# Altium schematic sheet LCD.SchDoc
size A3; SheetNumber: 4; SheetTotal: 7
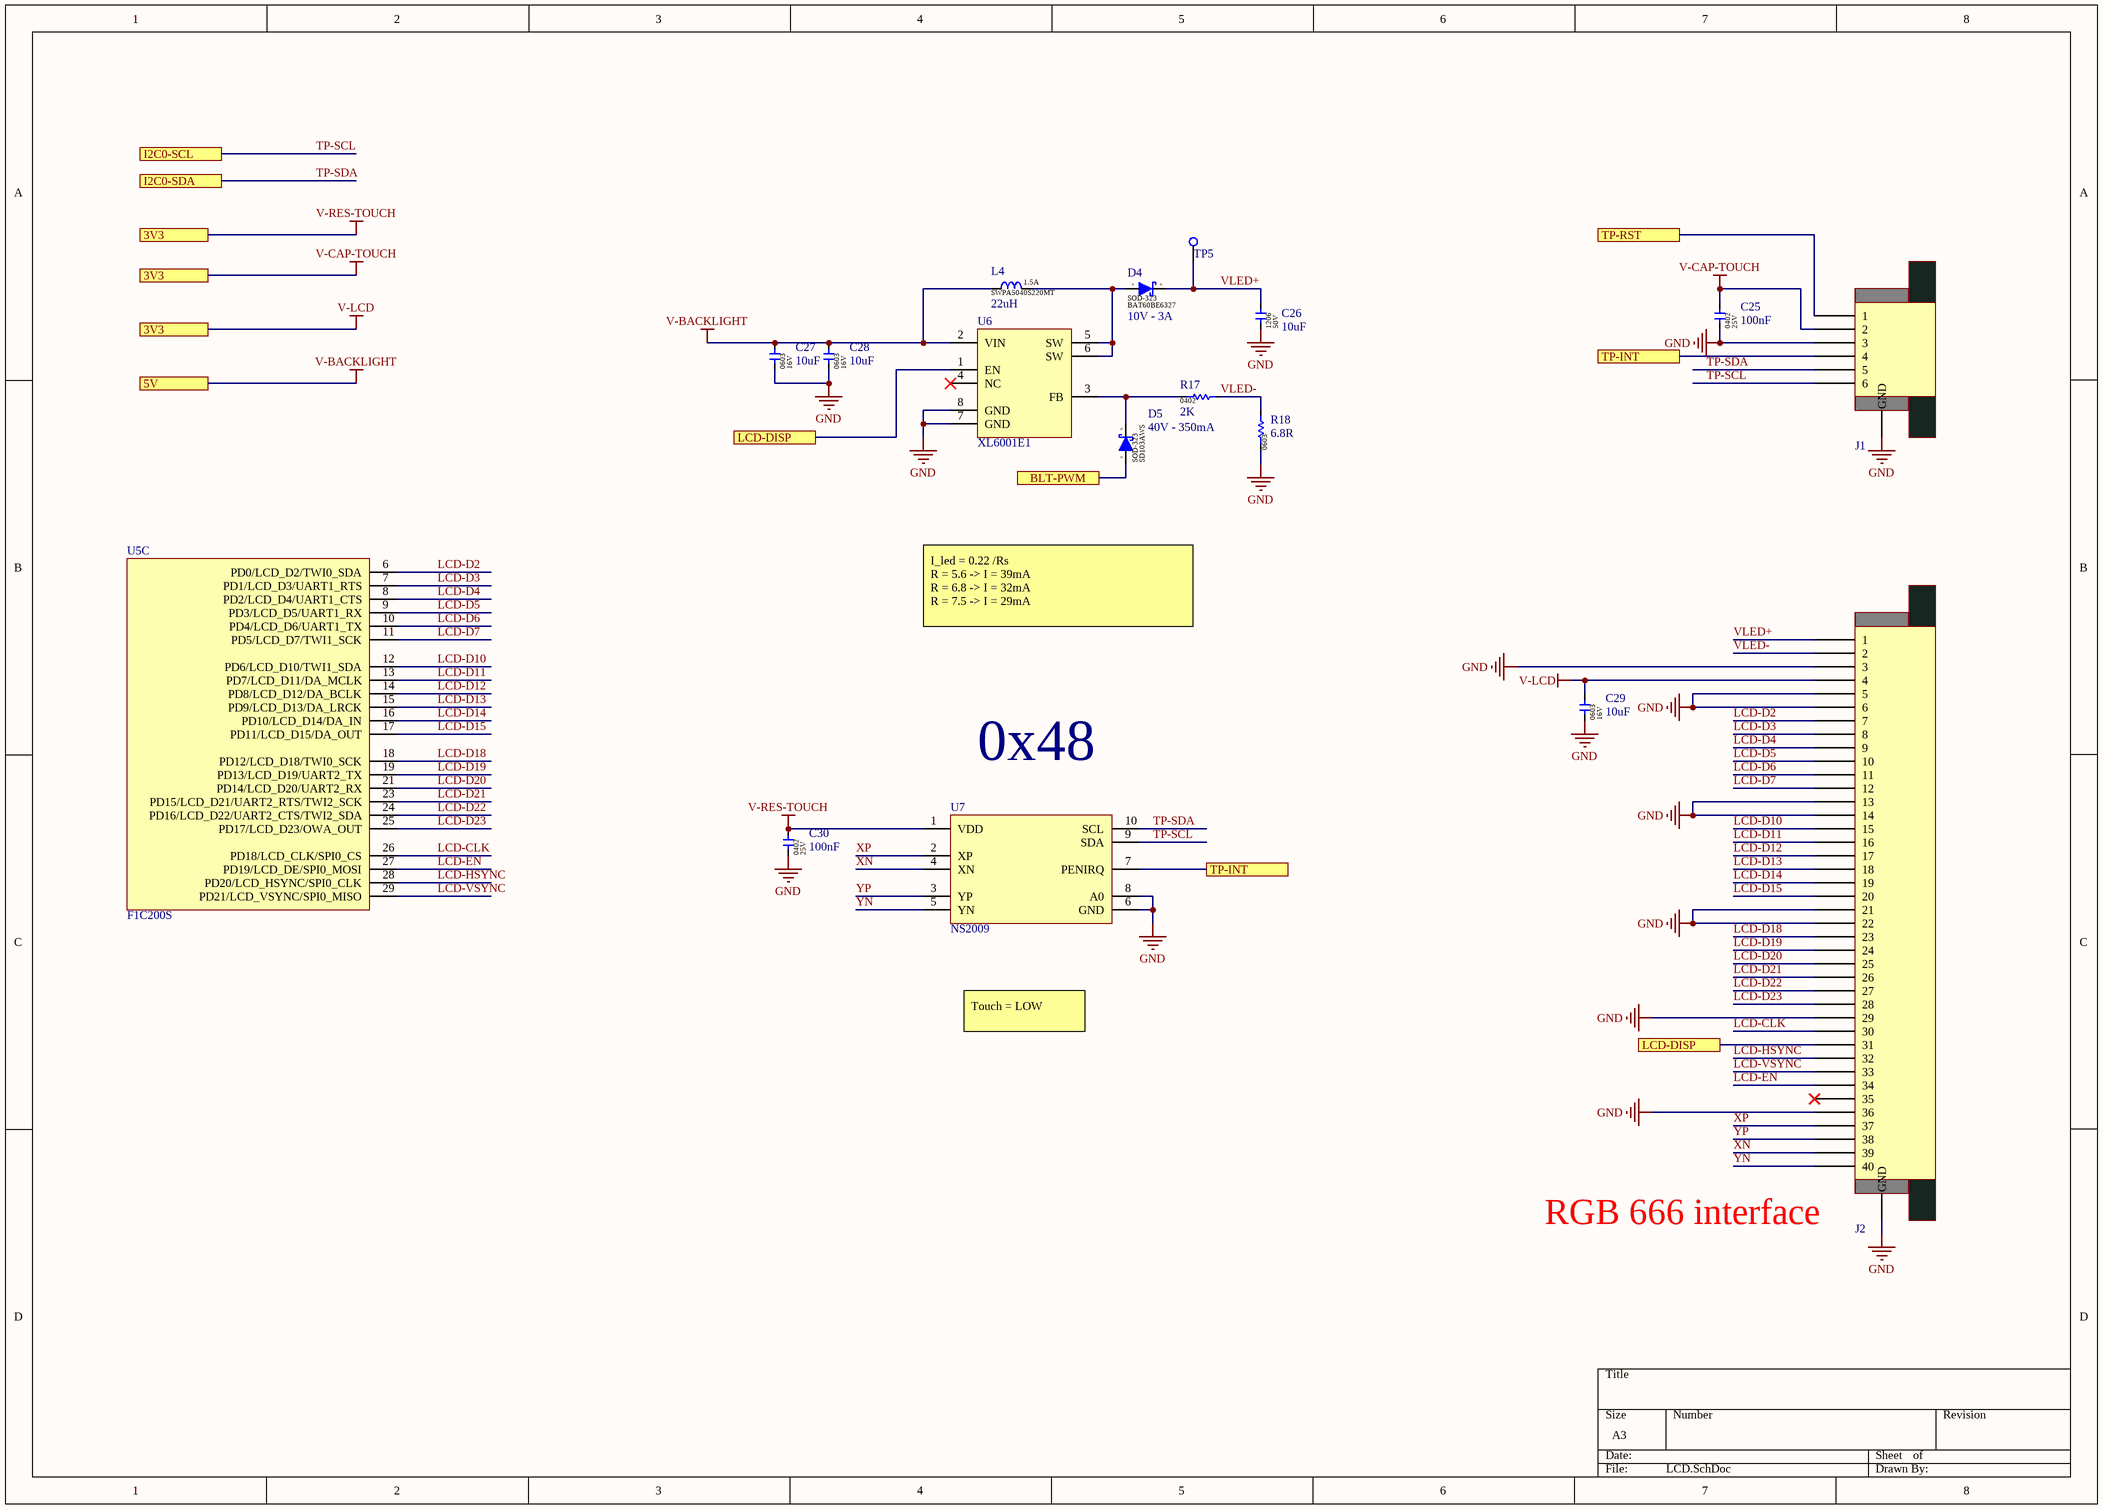
[diagram p0: LCD.SchDoc]

## Parts
C25  100nF  [CAP-0402]
C26  10uF  [CAP-1206]
C27  10uF  [CAP-0603]
C28  10uF  [CAP-0603]
C29  10uF  [CAP-0603]
C30  100nF  [CAP-0402]
D4  10V - 3A  [SOD323 (UNI)]
D5  40V - 350mA  [SOD323 (UNI)]
J1  AFC07-S06ECC-00  [FPC - 6P, 0.5mm, top]  (value not drawn)
J2  AFC07-S40ECC-00  [FPC - 40P, 0.5mm, top]  (value not drawn)
L4  22uH  [IND-5040]
R17  2K  [RES-0402]
R18  6.8R  [RES-0603]
TP5  N/A  [Test point]  (value not drawn)  (no BOM)
U5  F1C200S  [F1Cx00s]  (part C of 6)
U6  XL6001E1  [SOP-8]
U7  NS2009  [MSOP-10]

## Ports
3V3, 5V, BLT-PWM, I2C0-SCL, I2C0-SDA, LCD-DISP, TP-INT, TP-RST

## Nets
GND: C25.1 C26.1 C27.1 C28.1 C29.1 C30.1 J1.0(GND) J1.3 J2.0(GND) J2.3 J2.5 J2.6 J2.13 J2.14 J2.21 J2.22 J2.29 J2.36 R18.1 U6.7(GND) U6.8(GND) U7.6(GND) U7.8(A0)
V-BACKLIGHT: C27.2 C28.2 L4.1 U6.2(VIN) ; port 5V
V-CAP-TOUCH: C25.2 C29.2 C30.2 J1.2 J2.4 U7.1(VDD) ; port 3V3  [also labelled V-LCD, V-RES-TOUCH]
BLT-PWM: D5.2(Anode) ; port BLT-PWM
LCD-CLK: J2.30 U5.26(PD18/LCD_CLK/SPI0_CS)
LCD-D2: J2.7 U5.6(PD0/LCD_D2/TWI0_SDA)
LCD-D3: J2.8 U5.7(PD1/LCD_D3/UART1_RTS)
LCD-D4: J2.9 U5.8(PD2/LCD_D4/UART1_CTS)
LCD-D5: J2.10 U5.9(PD3/LCD_D5/UART1_RX)
LCD-D6: J2.11 U5.10(PD4/LCD_D6/UART1_TX)
LCD-D7: J2.12 U5.11(PD5/LCD_D7/TWI1_SCK)
LCD-D10: J2.15 U5.12(PD6/LCD_D10/TWI1_SDA)
LCD-D11: J2.16 U5.13(PD7/LCD_D11/DA_MCLK)
LCD-D12: J2.17 U5.14(PD8/LCD_D12/DA_BCLK)
LCD-D13: J2.18 U5.15(PD9/LCD_D13/DA_LRCK)
LCD-D14: J2.19 U5.16(PD10/LCD_D14/DA_IN)
LCD-D15: J2.20 U5.17(PD11/LCD_D15/DA_OUT)
LCD-D18: J2.23 U5.18(PD12/LCD_D18/TWI0_SCK)
LCD-D19: J2.24 U5.19(PD13/LCD_D19/UART2_TX)
LCD-D20: J2.25 U5.21(PD14/LCD_D20/UART2_RX)
LCD-D21: J2.26 U5.23(PD15/LCD_D21/UART2_RTS/TWI2_SCK)
LCD-D22: J2.27 U5.24(PD16/LCD_D22/UART2_CTS/TWI2_SDA)
LCD-D23: J2.28 U5.25(PD17/LCD_D23/OWA_OUT)
LCD-DISP: J2.31 U6.1(EN) ; port LCD-DISP
LCD-EN: J2.34 U5.27(PD19/LCD_DE/SPI0_MOSI)
LCD-HSYNC: J2.32 U5.28(PD20/LCD_HSYNC/SPI0_CLK)
LCD-VSYNC: J2.33 U5.29(PD21/LCD_VSYNC/SPI0_MISO)
TP-INT: J1.4 U7.7(PENIRQ) ; port TP-INT
TP-RST: J1.1 ; port TP-RST
TP-SCL: J1.6 U7.9(SDA) ; port I2C0-SCL
TP-SDA: J1.5 U7.10(SCL) ; port I2C0-SDA
VLED+: C26.2 D4.1(Cathode) J2.1 TP5.1
VLED-: J2.2 R17.2 R18.2
XN: J2.39 U7.4(XN)
XP: J2.37 U7.2(XP)
YN: J2.40 U7.5(YN)
YP: J2.38 U7.3(YP)
NetD4_2: D4.2(Anode) L4.2 U6.5(SW) U6.6(SW)
NetD5_1: D5.1(Cathode) R17.1 U6.3(FB)

Not connected (* = marked no-connect by the designer): J2 35*; U6 4(NC)*

## Notes on the sheet
- I_led = 0.22 /Rs
  R = 5.6 -> I = 39mA
  R = 6.8 -> I = 32mA
  R = 7.5 -> I = 29mA
- 0x48
- Touch = LOW
- (near J2) RGB 666 interface
- (in symbol BAT60BE6327) A; K
- (in symbol SD103AWS) K; A

## Library data of the parts
C25 C30 = 0402X104K250CT: 100nF ±10% 25V X5R 0402 Multilayer Ceramic Capacitors MLCC - SMD/SMT RoHS; Manufacture: WALSIN; Package / Case: 0402; Component type: Capacitor; Manufacture part: 0402X104K250CT; Capacitor value: 100nF; Voltage: 25V; Package: 0402
C26 = 1206X106K500CT: 10uF ±10% 50V X5R 1206 Multilayer Ceramic Capacitors MLCC - SMD/SMT RoHS; Manufacture: WALSIN; Package / Case: 0402; Component type: Capacitor; Manufacture part: 1206X106K500CT; Capacitor value: 10uF; Voltage: 50V; Package: 1206
C27-C29 = 0603X106M160CT: 16V 10uF X5R ±20% 0603 Multilayer Ceramic Capacitors MLCC - SMD/SMT ROHS; Manufacture: WALSIN; Package / Case: 0402; Component type: Capacitor; Manufacture part: 0603X106M160CT; Capacitor value: 10uF; Voltage: 16V; Package: 0603
D4 = BAT60BE6327: 10V 3A 600mV @ 1A SOD-323 Schottky Barrier Diodes (SBD) RoHS; Manufacture: Infineon Technologies; Manufacture part: BAT60BE6327; Type: Schottky diode; Diode value: 10V - 3A; Package: SOD-323; Datasheet: https://datasheet.lcsc.com/lcsc/1809021231_Infineon-Technologies-BAT60BE6327_C91059.pdf
D5 = SD103AWS: 40V 350mA 600mV @ 200mA SOD-323 Schottky Barrier Diodes (SBD) ROHS; Manufacture: Shikues; Manufacture part: SD103AWS; Type: Schottky diode; Diode value: 40V - 350mA; Package: SOD-323; Datasheet: https://datasheet.lcsc.com/lcsc/1809211226_Shikues-SD103AWS_C109204.pdf
J1 = AFC07-S06ECC-00: Slide Lock Contact,Top 6P FFC/FPC Connectors ROHS; Manufacture: JUSHUO; Manufacture part: AFC07-S06ECC-00; Type: FPC; Datasheet: https://datasheet.lcsc.com/lcsc/1811021327_JUSHUO-AFC07-S06ECC-00_C11083.pdf
J2 = AFC07-S40ECC-00: Contact,Top 40 0.020"（0.50mm） 0.079"（2.00mm） Slide Lock 40P FFC, FPC Connectors RoHS; Manufacture: JUSHUO; Manufacture part: AFC07-S40ECC-00; Type: FPC; Datasheet: https://datasheet.lcsc.com/lcsc/JUSHUO-AFC07-S40ECC-00_C11097.pdf
L4 = SWPA5040S220MT: Inductor 22uH ±20% 1.5A, 5.0x5.0x4; Manufacture: SUNLORD; DCR: 0.168 Ω; Manufacture part: SWPA5040S220MT; Inductance value: 22uH; Irms max: 1.5A; Package: 5040
R17 = WR04X2001FTL: 2kΩ ±1% 1/16W ±100ppm/℃ 0402 Chip Resistor - Surface Mount RoHS; Manufacture: WALSIN; Package / Case: 0201; Component type: Resistor; Manufacture part: WR04X2001FTL; Resistor value: 2K; Package: 0402
R18 = WR06W6R80FTL: 6.8Ω ±1% ±1% 0.1W -200ppm/℃~+400ppm/℃ 0603 Chip Resistor - Surface Mount RoHS; Manufacture: WALSIN; Package / Case: 0201; Component type: Resistor; Manufacture part: WR06W6R80FTL; Resistor value: 6.8R; Package: 0603
TP5 = N/A: A point used for measure.; Manufacture part: N/A; Manufacture: N/A; Type: Test point
U5 = F1C200S: The Allwinner F1C200s is a small SoC with an ARM926EJ-S CPU core and 64MB of embedded DDR SDRAM.; Manufacture part: F1C200S; Manufacture: Allwinner; Package: QFN-88 (10x10); Datasheet: https://linux-sunxi.org/images/1/11/Allwinner_F1C200s_Datasheet_V1.0.pdf
U6 = XL6001E1: SOIC-8_150mil LED Drivers RoHS; Manufacture: XLSEMI; Manufacture part: XL6001E1; Package: SOP-8; Datasheet: https://datasheet.lcsc.com/lcsc/1809191820_XLSEMI-XL6001E1_C73343.pdf
U7 = NS2009: MSOP-10 Touch Screen Controllers RoHS; Manufacture: Shenzhen Nsiway Tech; Manufacture part: NS2009; Package: MSOP-10; Datasheet: https://datasheet.lcsc.com/lcsc/1810181630_Shenzhen-Nsiway-Tech-NS2009_C219024.pdf